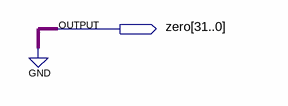
[diagram p0: schematic sheet]
// Quartus schematic zero32.bdf as structural Verilog: 0 symbols, 1 pins
module zero32 (
  output [31:0] zero
);


  assign zero = {32{1'b0}};
endmodule
